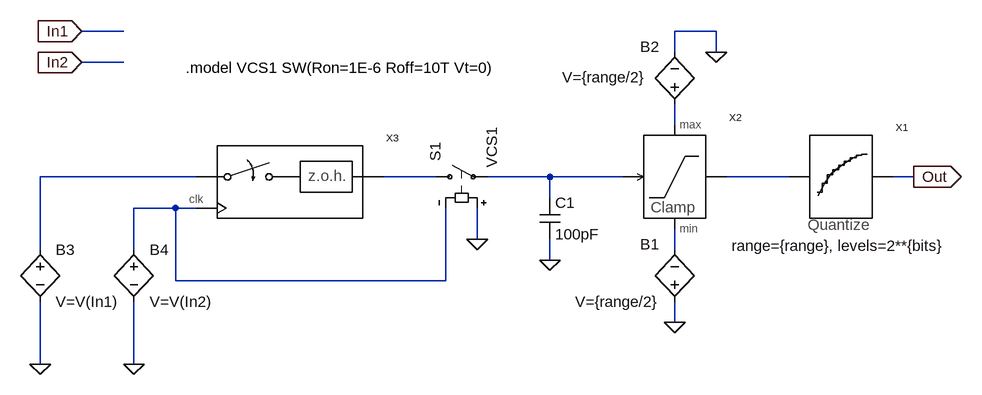
[diagram p0: schematic ADC.asc]
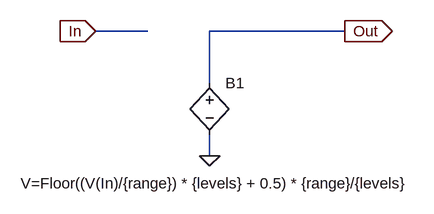
[diagram p1: sub-circuit quantize.asc]
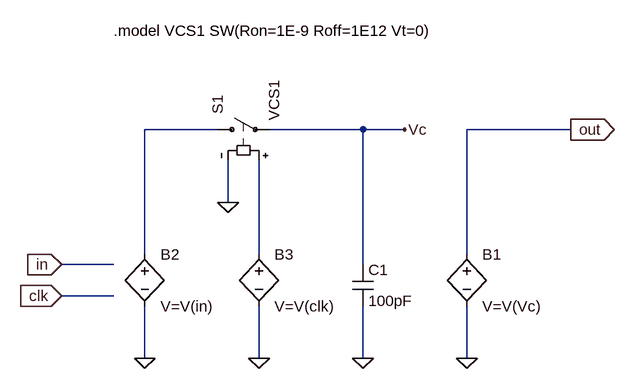
[diagram p2: sub-circuit s&h.asc]
ADC.asc, the LTspice schematic file:
Version 4
SHEET 1 1016 680
WIRE -928 -144 -992 -144
WIRE -16 -144 -80 -144
WIRE -80 -112 -80 -144
WIRE -16 -112 -16 -144
WIRE -928 -96 -992 -96
WIRE -80 0 -80 -32
WIRE -816 80 -1056 80
WIRE -448 80 -528 80
WIRE -272 80 -368 80
WIRE -160 80 -272 80
WIRE 96 80 0 80
WIRE 288 80 256 80
WIRE -272 112 -272 80
WIRE -848 128 -912 128
WIRE -816 128 -848 128
WIRE -384 176 -384 128
WIRE -1056 192 -1056 80
WIRE -912 192 -912 128
WIRE -80 192 -80 160
WIRE -272 208 -272 176
WIRE -848 240 -848 128
WIRE -432 240 -432 128
WIRE -432 240 -848 240
WIRE -80 304 -80 272
WIRE -1056 368 -1056 272
WIRE -912 368 -912 272
FLAG -16 -112 0
FLAG -80 304 0
FLAG 288 80 Out
IOPIN 288 80 Out
FLAG -992 -144 In1
IOPIN -992 -144 In
FLAG -992 -96 In2
IOPIN -992 -96 In
FLAG -1056 368 0
FLAG -912 368 0
FLAG -272 208 0
FLAG -384 176 0
SYMBOL Quantize 176 80 R0
WINDOW 39 -168 106 Left 0
SYMATTR SpiceLine range={range}, levels=2**{bits}
SYMATTR InstName X1
SYMBOL Clamp -80 80 R0
SYMATTR InstName X2
SYMBOL bv -80 288 R180
WINDOW 0 24 104 Left 0
WINDOW 3 24 16 Left 0
SYMATTR InstName B1
SYMATTR Value V={range/2}
SYMBOL bv -80 -16 R180
WINDOW 0 24 104 Left 0
WINDOW 3 44 57 Left 0
SYMATTR InstName B2
SYMATTR Value V={range/2}
SYMBOL S&H -672 80 R0
SYMATTR InstName X3
SYMBOL bv -1056 176 R0
SYMATTR InstName B3
SYMATTR Value V=V(In1)
SYMBOL bv -912 176 R0
SYMATTR InstName B4
SYMATTR Value V=V(In2)
SYMBOL sw -464 80 R270
WINDOW 3 13 103 Left 0
SYMATTR Value VCS1
SYMATTR InstName S1
SYMBOL cap -288 112 R0
SYMATTR InstName C1
SYMATTR Value 100pF
TEXT -832 -88 Left 0 !.model VCS1 SW(Ron=1E-6 Roff=10T Vt=0)

quantize.asc, the sub-circuit schematic file:
Version 4
SHEET 1 948 680
WIRE 144 96 64 96
WIRE 448 96 240 96
WIRE 240 176 240 96
WIRE 240 288 240 256
FLAG 64 96 In
IOPIN 64 96 In
FLAG 240 288 0
FLAG 448 96 Out
IOPIN 448 96 Out
SYMBOL bv 240 160 R0
WINDOW 3 -291 171 Left 0
SYMATTR Value V=Floor((V(In)/{range}) * {levels} + 0.5) * {range}/{levels}
SYMATTR InstName B1

s&h.asc, the sub-circuit schematic file:
Version 4
SHEET 1 880 680
WIRE -16 0 -128 0
WIRE 208 0 64 0
WIRE 272 0 208 0
WIRE 528 0 368 0
WIRE 0 112 0 48
WIRE -128 192 -128 0
WIRE 48 192 48 48
WIRE 368 192 368 0
WIRE -176 208 -256 208
WIRE 208 208 208 0
WIRE -176 256 -256 256
WIRE -128 352 -128 272
WIRE 48 352 48 272
WIRE 208 352 208 272
WIRE 368 352 368 272
FLAG 0 112 0
FLAG 208 352 0
FLAG 368 352 0
FLAG 272 0 Vc
FLAG -256 208 in
IOPIN -256 208 In
FLAG -256 256 clk
IOPIN -256 256 In
FLAG -128 352 0
FLAG 48 352 0
FLAG 528 0 out
IOPIN 528 0 Out
SYMBOL sw -32 0 R270
WINDOW 3 13 103 Left 0
SYMATTR Value VCS1
SYMATTR InstName S1
SYMBOL cap 192 208 R0
SYMATTR InstName C1
SYMATTR Value 100pF
SYMBOL bv 368 176 R0
SYMATTR InstName B1
SYMATTR Value V=V(Vc)
SYMBOL bv -128 176 R0
SYMATTR InstName B2
SYMATTR Value V=V(in)
SYMBOL bv 48 176 R0
SYMATTR InstName B3
SYMATTR Value V=V(clk)
TEXT -176 -152 Left 0 !.model VCS1 SW(Ron=1E-9 Roff=1E12 Vt=0)

The netlist it stands for:
* ADC.asc
XX1 N005 Out quantize params: range={range}, levels=2**{bits}
XX2 N004 N001 N007 N005 Clamp  ; pins in max min out
B1 0 N007 V={range/2}
B2 N001 0 V={range/2}
XX3 N002 N006 N003 s&h
B3 N002 0 V=V(In1)
B4 N006 0 V=V(In2)
S1 N003 N004 0 N006 VCS1
C1 N004 0 100pF

* block symbol definitions
.subckt quantize In Out
B1 Out 0 V=Floor((V(In)/{range}) * {levels} + 0.5) * {range}/{levels}
.ends quantize

.subckt s&h in clk out
S1 N001 Vc N002 0 VCS1
C1 Vc 0 100pF
B1 out 0 V=V(Vc)
B2 N001 0 V=V(in)
B3 N002 0 V=V(clk)
.model VCS1 SW(Ron=1E-9 Roff=1E12 Vt=0)
.ends s&h

.model VCS1 SW(Ron=1E-6 Roff=10T Vt=0)
.backanno
.end